# Altium schematic sheet AQCA-Control-uC-B0.SchDoc
size A4
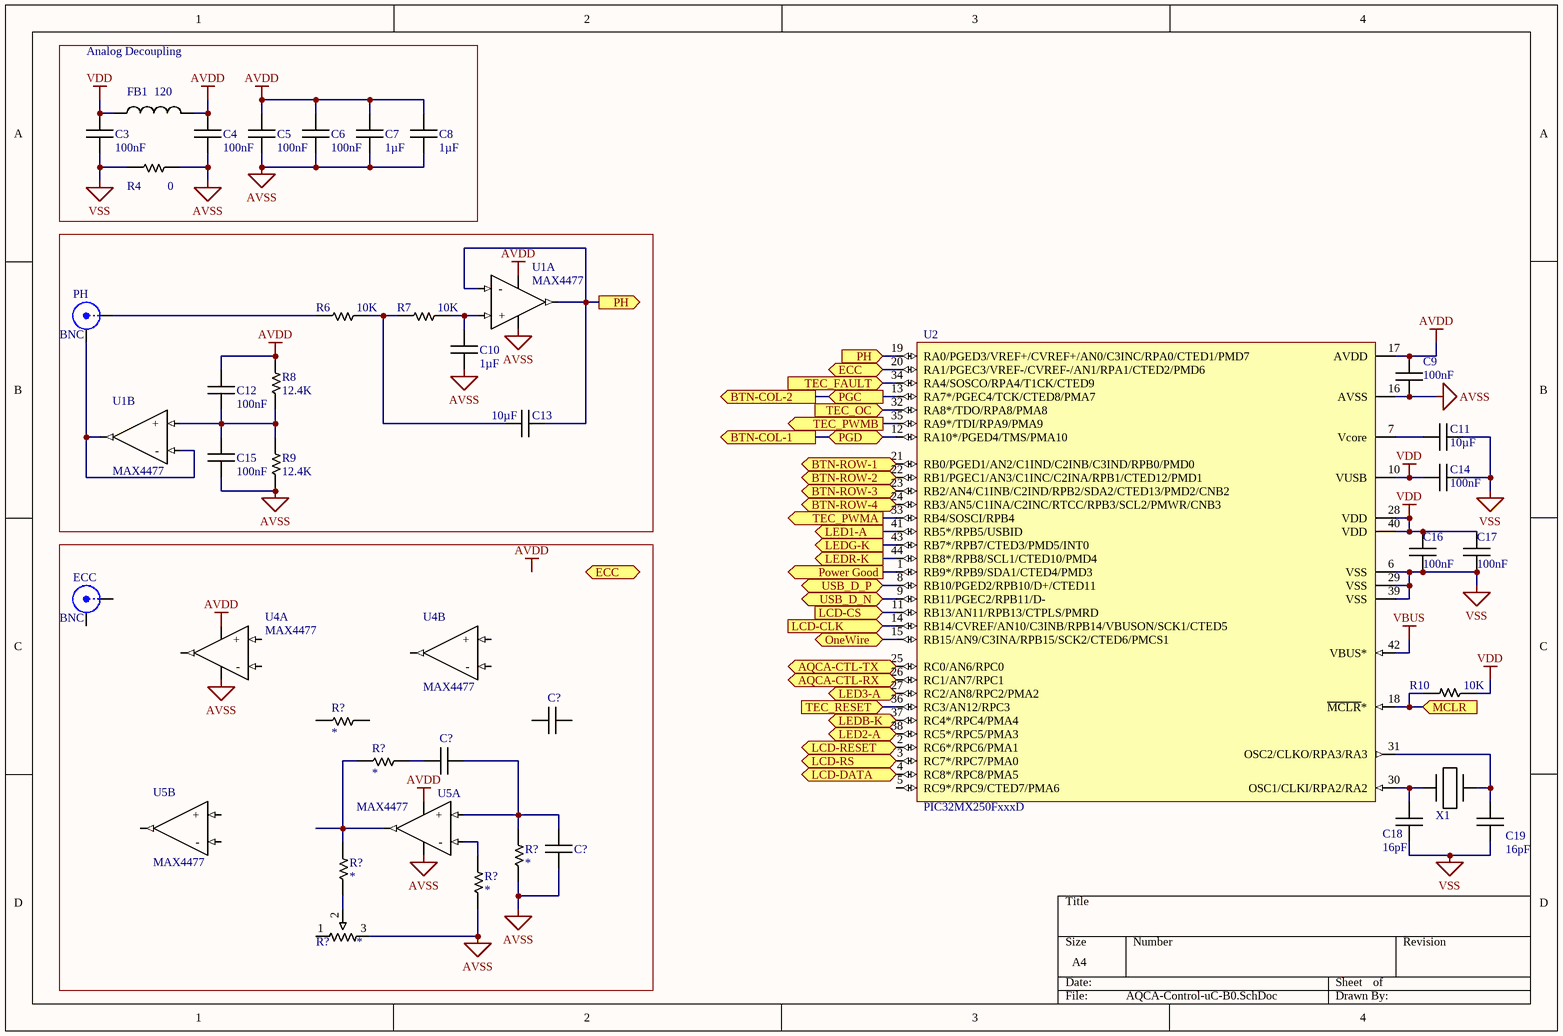
[diagram p0: AQCA-Control-uC-B0.SchDoc]

## Parts
(Parts that share a designator on the sheet are numbered #1, #2 ... from top to bottom, then left to right.)
C3  100nF  [CAPC1608N]
C4  100nF  [CAPC1608N]
C5  100nF  [CAPC1608N]
C6  100nF  [CAPC1608N]
C7  1µF  [CAPC1608N]
C8  1µF  [CAPC1608N]
C9  100nF  [CAPC1608N]
C10  1µF  [CAPC1608N]
C11  10µF  [CAPC2012N]
C12  100nF  [CAPC1608N]
C13  10µF  [CAPC3225N]
C14  100nF  [CAPC1608N]
C15  100nF  [CAPC1608N]
C16  100nF  [CAPC1608N]
C17  100nF  [CAPC1608N]
C18  16pF  [CAPC1608N]
C19  16pF  [CAPC1608N]
C?#1  (no value)  [CAPC1608N]
C?#2  (no value)  [CAPC1608N]
C?#3  (no value)  [CAPC1608N]
ECC  BNC  [BNC_RA CON]
FB1  120  [INDC1608N]
PH  BNC  [BNC_RA CON]
R4  0  [RESC1608N]
R6  10K  [RESC1608N]
R7  10K  [RESC1608N]
R8  12.4K  [RESC1608N]
R9  12.4K  [RESC1608N]
R10  10K  [RESC1608N]
R?#1  *  [RESC1608N]
R?#2  *  [RESC1608N]
R?#3  *  [RESC1608N]
R?#4  *  [RESC1608N]
R?#5  *  [RESC1608N]
R?#6  *  [Trim-Pot 2mm SMD]
U1  MAX4477  [UMAX8_N]  (parts A,B of 2)
U2  PIC32MX250FxxxD  [TQFP44_N]
U4  MAX4477  [UMAX8_N]  (parts A,B of 2)
U5  MAX4477  [UMAX8_N]  (parts A,B of 2)
X1  Crystal  [Quartz Can 2.1mm Hor]  (value not drawn)

## Blocks framed on the sheet
Analog Decoupling: C3-C8 FB1 R4

## Ports
AQCA-CTL-RX (in), AQCA-CTL-TX (out), BTN-COL-1 (out), BTN-COL-2 (out), BTN-ROW-1 (in), BTN-ROW-2 (in), BTN-ROW-3 (in), BTN-ROW-4 (in), ECC, LCD-CLK (in), LCD-CS (in), LCD-DATA (in), LCD-RESET (in), LCD-RS (in), LED1-A (out), LED2-A (out), LED3-A (out), LEDB-K (out), LEDG-K (out), LEDR-K (out), MCLR (in), OneWire (bidir), PGC (in), PGD (bidir), PH (in), PH (out), Power Good (out), TEC_FAULT (in), TEC_OC (in), TEC_PWMA (out), TEC_PWMB (out), TEC_RESET (in), USB_D_N (bidir), USB_D_P (bidir)

## Nets
AVDD: C4.2 C5.2 C6.2 C7.2 C8.2 C9.2 C12.2 FB1.2 R8.2 U1.8(V+) U2.17(AVDD) U4.4(V-) U5.4(V-)
AVSS: C4.1 C5.1 C6.1 C7.1 C8.1 C9.1 C10.1 C15.1 C?#3.1 R4.2 R9.1 R?#3.1 R?#5.1 R?#6.3 U1.4(V-) U2.16(AVSS) U4.8(V+) U5.8(V+)
VBUS: U2.42(VBUS*)
VDD: C3.2 C14.2 C16.2 C17.2 FB1.1 R10.1 U2.10(VUSB) U2.28(VDD) U2.40(VDD)
VSS: C3.1 C11.2 C14.1 C16.1 C17.1 C18.1 C19.1 R4.1 U2.6(VSS) U2.29(VSS) U2.39(VSS)
AQCA-CTL-RX: U2.26(RC1/AN7/RPC1) ; port AQCA-CTL-RX
AQCA-CTL-TX: U2.25(RC0/AN6/RPC0) ; port AQCA-CTL-TX
BTN-COL-1: U2.12(RA10*/PGED4/TMS/PMA10) ; port PGD, port BTN-COL-1
BTN-COL-2: U2.13(RA7*/PGEC4/TCK/CTED8/PMA7) ; port PGC, port BTN-COL-2
BTN-ROW-1: U2.21(RB0/PGED1/AN2/C1IND/C2INB/C3IND/RPB0/PMD0) ; port BTN-ROW-1
BTN-ROW-2: U2.22(RB1/PGEC1/AN3/C1INC/C2INA/RPB1/CTED12/PMD1) ; port BTN-ROW-2
BTN-ROW-3: U2.23(RB2/AN4/C1INB/C2IND/RPB2/SDA2/CTED13/PMD2/CNB2) ; port BTN-ROW-3
BTN-ROW-4: U2.24(RB3/AN5/C1INA/C2INC/RTCC/RPB3/SCL2/PMWR/CNB3) ; port BTN-ROW-4
ECC: U2.20(RA1/PGEC3/VREF-/CVREF-/AN1/RPA1/CTED2/PMD6) ; port ECC
LCD-CLK: U2.14(RB14/CVREF/AN10/C3INB/RPB14/VBUSON/SCK1/CTED5) ; port LCD-CLK
LCD-CS: U2.11(RB13/AN11/RPB13/CTPLS/PMRD) ; port LCD-CS
LCD-DATA: U2.4(RC8*/RPC8/PMA5) ; port LCD-DATA
LCD-RESET: U2.2(RC6*/RPC6/PMA1) ; port LCD-RESET
LCD-RS: U2.3(RC7*/RPC7/PMA0) ; port LCD-RS
LED1-A: U2.41(RB5*/RPB5/USBID) ; port LED1-A
LED2-A: U2.38(RC5*/RPC5/PMA3) ; port LED2-A
LED3-A: U2.27(RC2/AN8/RPC2/PMA2) ; port LED3-A
LEDB-K: U2.37(RC4*/RPC4/PMA4) ; port LEDB-K
LEDG-K: U2.43(RB7*/RPB7/CTED3/PMD5/INT0) ; port LEDG-K
LEDR-K: U2.44(RB8*/RPB8/SCL1/CTED10/PMD4) ; port LEDR-K
MCLR: R10.2 U2.18(~{MCLR}*) ; port MCLR
OneWire: U2.15(RB15/AN9/C3INA/RPB15/SCK2/CTED6/PMCS1) ; port OneWire
PH: C13.1 U1.1(O) U1.2(-) U2.19(RA0/PGED3/VREF+/CVREF+/AN0/C3INC/RPA0/CTED1/PMD7) ; port PH
Power Good: U2.1(RB9*/RPB9/SDA1/CTED4/PMD3) ; port Power Good
TEC_FAULT: U2.34(RA4/SOSCO/RPA4/T1CK/CTED9) ; port TEC_FAULT
TEC_OC: U2.32(RA8*/TDO/RPA8/PMA8) ; port TEC_OC
TEC_PWMA: U2.33(RB4/SOSCI/RPB4) ; port TEC_PWMA
TEC_PWMB: U2.35(RA9*/TDI/RPA9/PMA9) ; port TEC_PWMB
TEC_RESET: U2.36(RC3/AN12/RPC3) ; port TEC_RESET
USB_D_N: U2.9(RB11/PGEC2/RPB11/D-) ; port USB_D_N
USB_D_P: U2.8(RB10/PGED2/RPB10/D+/CTED11) ; port USB_D_P
NetC10_2: C10.2 R7.2 U1.3(+)
NetC11_1: C11.1 U2.7(Vcore)
NetC12_1: C12.1 C15.2 R8.1 R9.2 U1.5(+)
NetC13_2: C13.2 R6.2 R7.1
NetC18_2: C18.2 U2.30(OSC1/CLKI/RPA2/RA2) X1.1
NetC19_2: C19.2 U2.31(OSC2/CLKO/RPA3/RA3) X1.2
NetC?#2_1: C?#2.1 R?#2.2
NetC?#2_2: C?#2.2 C?#3.2 R?#3.2 U5.3(+)
NetPH_1: PH.1(X) R6.1
NetPH_2: PH.2(Y) U1.6(-) U1.7(O)
NetR?#2_1: R?#2.1 R?#4.2 U5.1(O)
NetR?#4_1: R?#4.1 R?#6.2
NetR?#5_2: R?#5.2 U5.2(-)

Not connected (* = marked no-connect by the designer): C?#1 1 2; ECC 1(X) 2(Y); R?#1 1 2; R?#6 1; U2 5(RC9*/RPC9/CTED7/PMA6); U4 1(O) 2(-) 3(+) 5(+) 6(-) 7(O); U5 5(+) 6(-) 7(O)

## Notes on the sheet
- Labels drawn without touching a wire or pin: AVDD

## Library data of the parts
C3-C6 C9 C10 C12-C17 = Capacitor: Voltage: 16V
  C3-C6 C9 C12 C14-C17: Value: 100nF
  C10: Value: 1µF
  C13: Value: 10µF
C7 C8 = Capacitor: Voltage: 25V; Value: 1µF
C11 = Capacitor: Voltage: 10V; Value: 10µF
C18 C19 = Capacitor: Voltage: 50V; Value: 16pF
C?#1-C?#3 = Capacitor
ECC PH = BNC: BNC Elbow Connector; LatestRevisionDate: 17-Jul-2002; LatestRevisionNote: Re-released for DXP Platform.; Publisher: Altium Limited
FB1 = Inductor: DC Current: 700mA; Value: 120
R4 R6-R10 R?#1-R?#5 = Resistor
  R4: Value: 0
  R6 R7 R10: Value: 10K
  R8 R9: Value: 12.4K
  R?#1-R?#5: Value: *
R?#6 = Potentiometer: Value: *
U1 U4 U5 = Opamp dual: Model: MAX4477
U2 = PIC32MX250FxxxD: Model: PIC32MX250F128D
X1 = Crystal: Frequency: 116MHz; Precision: 100ppm; Stability: 100ppm